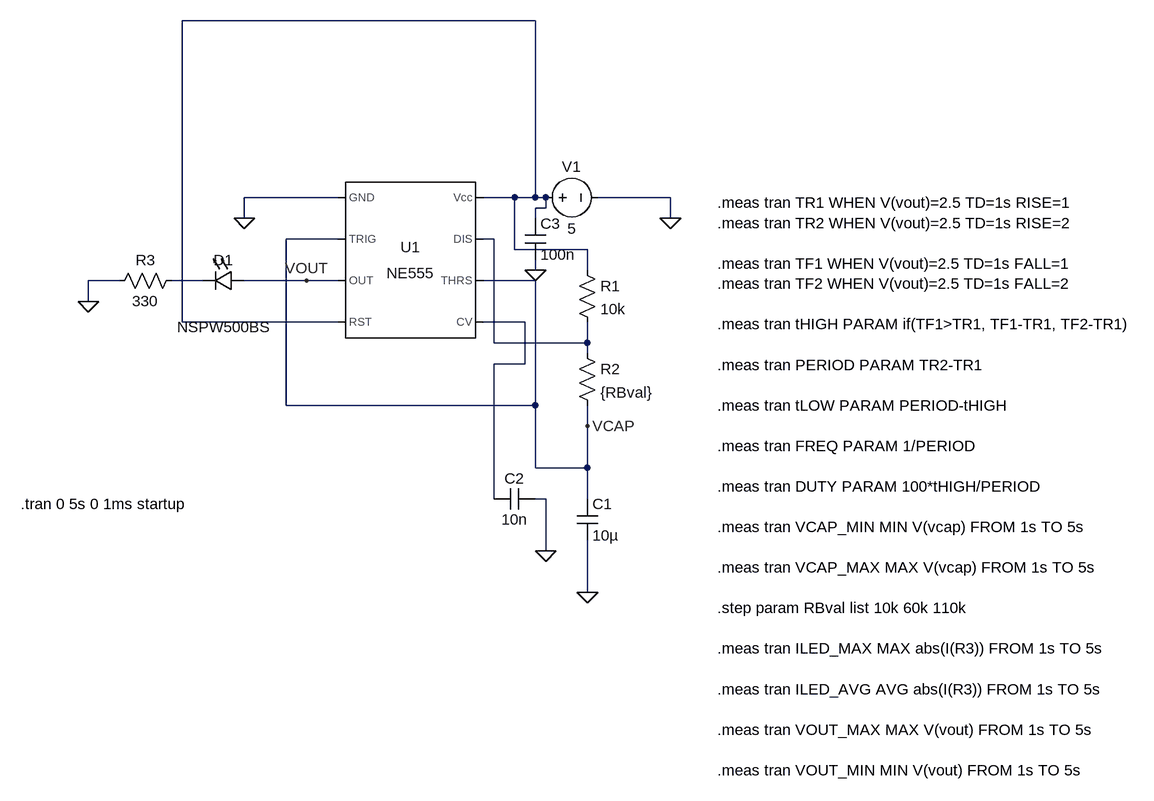
[diagram p0: schematic pcb001_ne555_astable.asc]
pcb001_ne555_astable.asc, the LTspice schematic file:
Version 4.1
SHEET 1 1800 888
WIRE 400 -192 -144 -192
WIRE 96 80 -48 80
WIRE 368 80 320 80
WIRE 400 80 400 -192
WIRE 400 80 368 80
WIRE 416 80 400 80
WIRE 608 80 496 80
WIRE 416 96 416 80
WIRE 416 96 400 96
WIRE -48 112 -48 80
WIRE 400 112 400 96
WIRE 608 112 608 80
WIRE 96 144 16 144
WIRE 336 144 320 144
WIRE 368 160 368 80
WIRE 480 160 368 160
WIRE 400 192 400 176
WIRE 480 192 480 160
WIRE -240 208 -288 208
WIRE -112 208 -160 208
WIRE 48 208 -48 208
WIRE 96 208 48 208
WIRE 400 208 320 208
WIRE -288 240 -288 208
WIRE -144 272 -144 -192
WIRE 96 272 -144 272
WIRE 384 272 320 272
WIRE 336 304 336 144
WIRE 480 304 480 272
WIRE 480 304 336 304
WIRE 480 320 480 304
WIRE 384 336 384 272
WIRE 384 336 336 336
WIRE 16 400 16 144
WIRE 400 400 400 208
WIRE 400 400 16 400
WIRE 480 432 480 400
WIRE 400 496 400 400
WIRE 480 496 480 432
WIRE 480 496 400 496
WIRE 336 544 336 336
WIRE 416 544 400 544
WIRE 480 544 480 496
WIRE 416 624 416 544
WIRE 480 688 480 608
FLAG 608 112 0
FLAG -48 112 0
FLAG 480 688 0
FLAG 416 624 0
FLAG -288 240 0
FLAG 400 192 0
FLAG 480 432 VCAP
FLAG 48 208 VOUT
SYMBOL Misc\\NE555 208 176 R0
SYMATTR InstName U1
SYMBOL voltage 400 80 R270
WINDOW 0 32 56 VTop 2
WINDOW 3 -32 56 VBottom 2
WINDOW 123 0 0 Left 0
WINDOW 39 0 0 Left 0
SYMATTR InstName V1
SYMATTR Value 5
SYMBOL res 464 176 R0
SYMATTR InstName R1
SYMATTR Value 10k
SYMBOL res 464 304 R0
SYMATTR InstName R2
SYMATTR Value {RBval}
SYMBOL cap 464 544 R0
SYMATTR InstName C1
SYMATTR Value 10µ
SYMBOL cap 400 528 R90
WINDOW 0 0 32 VBottom 2
WINDOW 3 32 32 VTop 2
SYMATTR InstName C2
SYMATTR Value 10n
SYMBOL LED -48 192 R90
WINDOW 0 0 32 VBottom 2
WINDOW 3 72 32 VTop 2
SYMATTR InstName D1
SYMATTR Value NSPW500BS
SYMBOL res -144 192 R90
WINDOW 0 0 56 VBottom 2
WINDOW 3 32 56 VTop 2
SYMATTR InstName R3
SYMATTR Value 330
SYMBOL cap 384 112 R0
SYMATTR InstName C3
SYMATTR Value 100n
TEXT -392 552 Left 2 !.tran 0 5s 0 1ms startup
TEXT 680 88 Left 2 !.meas tran TR1 WHEN V(vout)=2.5 TD=1s RISE=1\n.meas tran TR2 WHEN V(vout)=2.5 TD=1s RISE=2\n \n.meas tran TF1 WHEN V(vout)=2.5 TD=1s FALL=1\n.meas tran TF2 WHEN V(vout)=2.5 TD=1s FALL=2\n \n.meas tran tHIGH PARAM if(TF1>TR1, TF1-TR1, TF2-TR1)\n \n.meas tran PERIOD PARAM TR2-TR1\n \n.meas tran tLOW PARAM PERIOD-tHIGH\n \n.meas tran FREQ PARAM 1/PERIOD\n \n.meas tran DUTY PARAM 100*tHIGH/PERIOD\n \n.meas tran VCAP_MIN MIN V(vcap) FROM 1s TO 5s\n \n.meas tran VCAP_MAX MAX V(vcap) FROM 1s TO 5s\n \n.step param RBval list 10k 60k 110k\n \n.meas tran ILED_MAX MAX abs(I(R3)) FROM 1s TO 5s\n \n.meas tran ILED_AVG AVG abs(I(R3)) FROM 1s TO 5s\n \n.meas tran VOUT_MAX MAX V(vout) FROM 1s TO 5s\n \n.meas tran VOUT_MIN MIN V(vout) FROM 1s TO 5s

The netlist it stands for:
* pcb001_ne555_astable.asc
X§U1 0 VCAP VOUT N001 N004 VCAP N002 N001 NE555  ; pins GND TRIG OUT RST CV THRS DIS Vcc
V1 N001 0 5
R1 N001 N002 10k
R2 N002 VCAP {RBval}
C1 VCAP 0 10µ
C2 0 N004 10n
D1 VOUT N003 NSPW500BS
R3 N003 0 330
C3 N001 0 100n
.model D D
.lib standard.dio
.tran 0 5s 0 1ms startup
.meas tran TR1 WHEN V(vout)=2.5 TD=1s RISE=1
.meas tran TR2 WHEN V(vout)=2.5 TD=1s RISE=2
.meas tran TF1 WHEN V(vout)=2.5 TD=1s FALL=1
.meas tran TF2 WHEN V(vout)=2.5 TD=1s FALL=2
.meas tran tHIGH PARAM if(TF1>TR1, TF1-TR1, TF2-TR1)
.meas tran PERIOD PARAM TR2-TR1
.meas tran tLOW PARAM PERIOD-tHIGH
.meas tran FREQ PARAM 1/PERIOD
.meas tran DUTY PARAM 100*tHIGH/PERIOD
.meas tran VCAP_MIN MIN V(vcap) FROM 1s TO 5s
.meas tran VCAP_MAX MAX V(vcap) FROM 1s TO 5s
.step param RBval list 10k 60k 110k
.meas tran ILED_MAX MAX abs(I(R3)) FROM 1s TO 5s
.meas tran ILED_AVG AVG abs(I(R3)) FROM 1s TO 5s
.meas tran VOUT_MAX MAX V(vout) FROM 1s TO 5s
.meas tran VOUT_MIN MIN V(vout) FROM 1s TO 5s
.lib NE555.sub
.backanno
.end

* Results of the author's LTspice run, read from the files saved beside the schematic
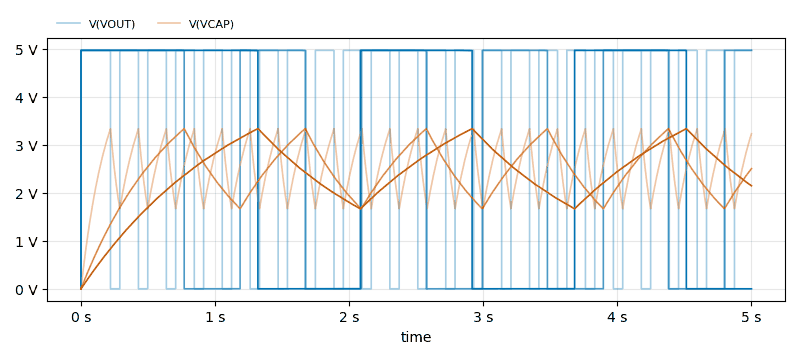
[diagram p1: Transient Analysis of pcb001_ne555_astable.asc, plotted from the saved traces]
* Transient Analysis, 3 runs:
*   V(VOUT) [rbval=10000]: min 0 V, max 4.964 V, average 3.376 V, rms 4.094 V, last 4.964 V
*   V(VOUT) [rbval=60000]: min 0 V, max 4.964 V, average 2.894 V, rms 3.791 V, last 4.964 V
*   V(VOUT) [rbval=110000]: min 0 V, max 4.964 V, average 2.964 V, rms 3.836 V, last 30 µV
*   V(VCAP) [rbval=10000]: min 0 V, max 3.334 V, average 2.504 V, rms 2.563 V, last 3.231 V
*   V(VCAP) [rbval=60000]: min 0 V, max 3.334 V, average 2.399 V, rms 2.479 V, last 2.501 V
*   V(VCAP) [rbval=110000]: min 0 V, max 3.334 V, average 2.381 V, rms 2.481 V, last 2.145 V
* From the log:
*   Measurement: tr1
*     step  V(vout)=2.5
*        1  1.12281239867
*        2  1.18652501271
*        3  2.08367191245
*   Measurement: tr2
*     step  V(vout)=2.5
*        1  1.33116593501
*        2  2.08941070582
*        3  3.68110046401
*   Measurement: tf1
*     step  V(vout)=2.5
*        1  1.0532776495
*        2  1.67244992358
*        3  1.3193551348
*   Measurement: tf2
*     step  V(vout)=2.5
*        1  1.26163118584
*        2  2.57533561778
*        3  2.9167836956
*   Measurement: thigh
*     step  if(TF1>TR1, TF1-TR1, TF2-TR1)
*        1  0.138818787179
*        2  0.485924910876
*        3  0.833111783155
*   Measurement: period
*     step  TR2-TR1
*        1  0.208353536348
*        2  0.902885693113
*        3  1.59742855157
*   Measurement: tlow
*     step  PERIOD-tHIGH
*        1  0.0695347491695
*        2  0.416960782236
*        3  0.764316768411
*   Measurement: freq
*     step  1/PERIOD
*        1  4.79953456767
*        2  1.10755991332
*        3  0.626006088986
*   Measurement: duty
*     step  100*tHIGH/PERIOD
*        1  66.6265567707
*        2  53.8190952169
*        3  52.1533049061
*   Measurement: vcap_min
*     step  MIN(V(vcap))  FROM  TO
*        1  1.66566622257  1  5
*        2  1.66566741467  1  5
*        3  1.66566753387  1  5
*   Measurement: vcap_max
*     step  MAX(V(vcap))  FROM  TO
*        1  3.3343334198  1  5
*        2  3.33433270454  1  5
*        3  3.33433246613  1  5
*   Measurement: iled_max
*     step  MAX(abs(I(R3)))  FROM  TO
*        1  0.00900516007096  1  5
*        2  0.00900594517589  1  5
*        3  0.00900594517589  1  5
*   Measurement: iled_avg
*     step  AVG(abs(I(R3)))  FROM  TO
*        1  0.0039800576466  1  5
*        2  0.00318801690483  1  5
*        3  0.00295015567704  1  5
*   Measurement: vout_max
*     step  MAX(V(vout))  FROM  TO
*        1  4.96431541443  1  5
*        2  4.96431541443  1  5
*        3  4.96431541443  1  5
*   Measurement: vout_min
*     step  MIN(V(vout))  FROM  TO
*        1  2.9999850085e-05  1  5
*        2  2.9999850085e-05  1  5
*        3  2.9999850085e-05  1  5